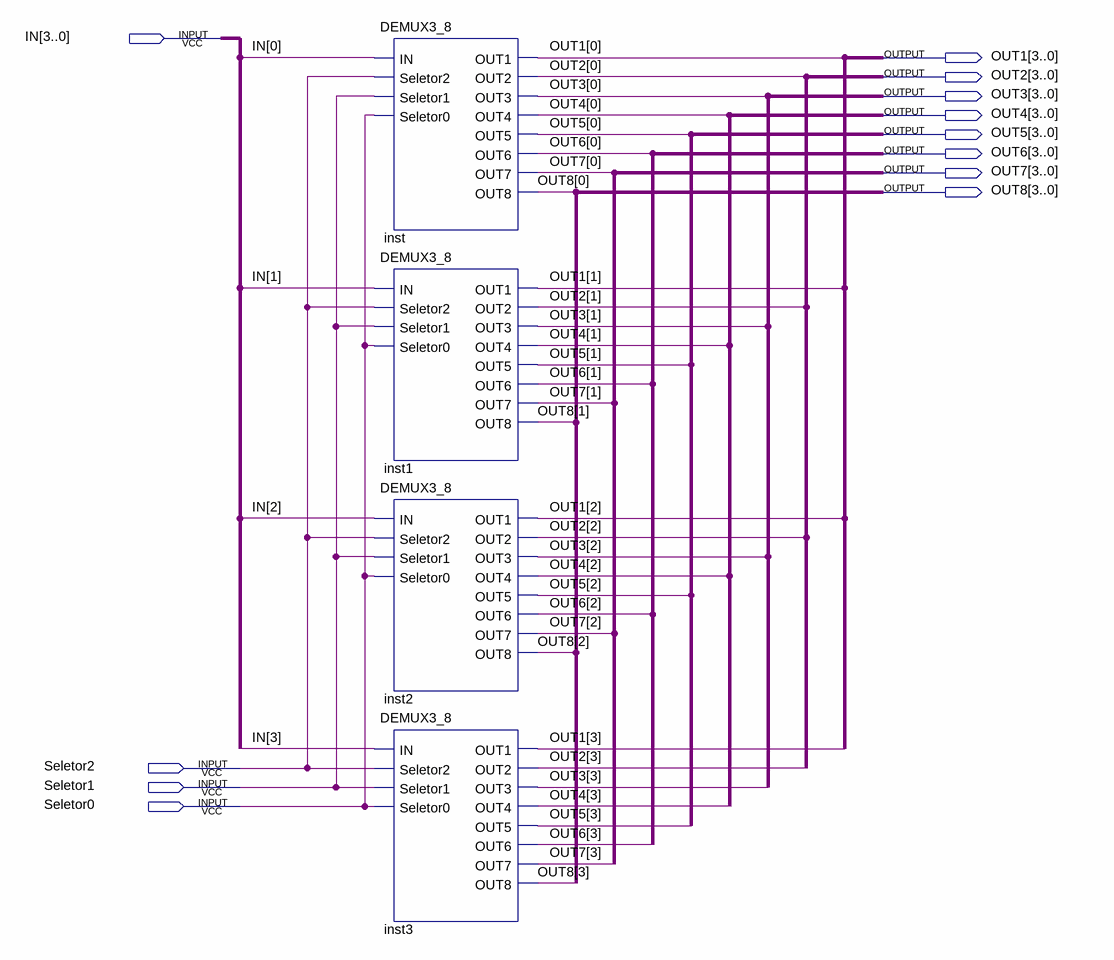
[diagram p0: schematic sheet]
// Quartus schematic DEMUX3_8_4bits.bdf as structural Verilog: 4 symbols, 12 pins
module DEMUX3_8_4bits (
  input  [3:0] IN,
  input  Seletor2,
  input  Seletor1,
  input  Seletor0,
  output [3:0] OUT1,
  output [3:0] OUT2,
  output [3:0] OUT3,
  output [3:0] OUT4,
  output [3:0] OUT5,
  output [3:0] OUT6,
  output [3:0] OUT7,
  output [3:0] OUT8
);

  DEMUX3_8 inst (
    .IN(IN[0]), .Seletor2(Seletor2), .Seletor1(Seletor1), .Seletor0(Seletor0), .OUT1(OUT1[0]),
    .OUT2(OUT2[0]), .OUT3(OUT3[0]), .OUT4(OUT4[0]), .OUT5(OUT5[0]), .OUT6(OUT6[0]), .OUT7(OUT7[0]),
    .OUT8(OUT8[0]));
  DEMUX3_8 inst1 (
    .IN(IN[1]), .Seletor2(Seletor2), .Seletor1(Seletor1), .Seletor0(Seletor0), .OUT1(OUT1[1]),
    .OUT2(OUT2[1]), .OUT3(OUT3[1]), .OUT4(OUT4[1]), .OUT5(OUT5[1]), .OUT6(OUT6[1]), .OUT7(OUT7[1]),
    .OUT8(OUT8[1]));
  DEMUX3_8 inst2 (
    .IN(IN[2]), .Seletor2(Seletor2), .Seletor1(Seletor1), .Seletor0(Seletor0), .OUT1(OUT1[2]),
    .OUT2(OUT2[2]), .OUT3(OUT3[2]), .OUT4(OUT4[2]), .OUT5(OUT5[2]), .OUT6(OUT6[2]), .OUT7(OUT7[2]),
    .OUT8(OUT8[2]));
  DEMUX3_8 inst3 (
    .IN(IN[3]), .Seletor2(Seletor2), .Seletor1(Seletor1), .Seletor0(Seletor0), .OUT1(OUT1[3]),
    .OUT2(OUT2[3]), .OUT3(OUT3[3]), .OUT4(OUT4[3]), .OUT5(OUT5[3]), .OUT6(OUT6[3]), .OUT7(OUT7[3]),
    .OUT8(OUT8[3]));
endmodule
